# EAGLE schematic GaugeRev2 (EAGLE 6.2)
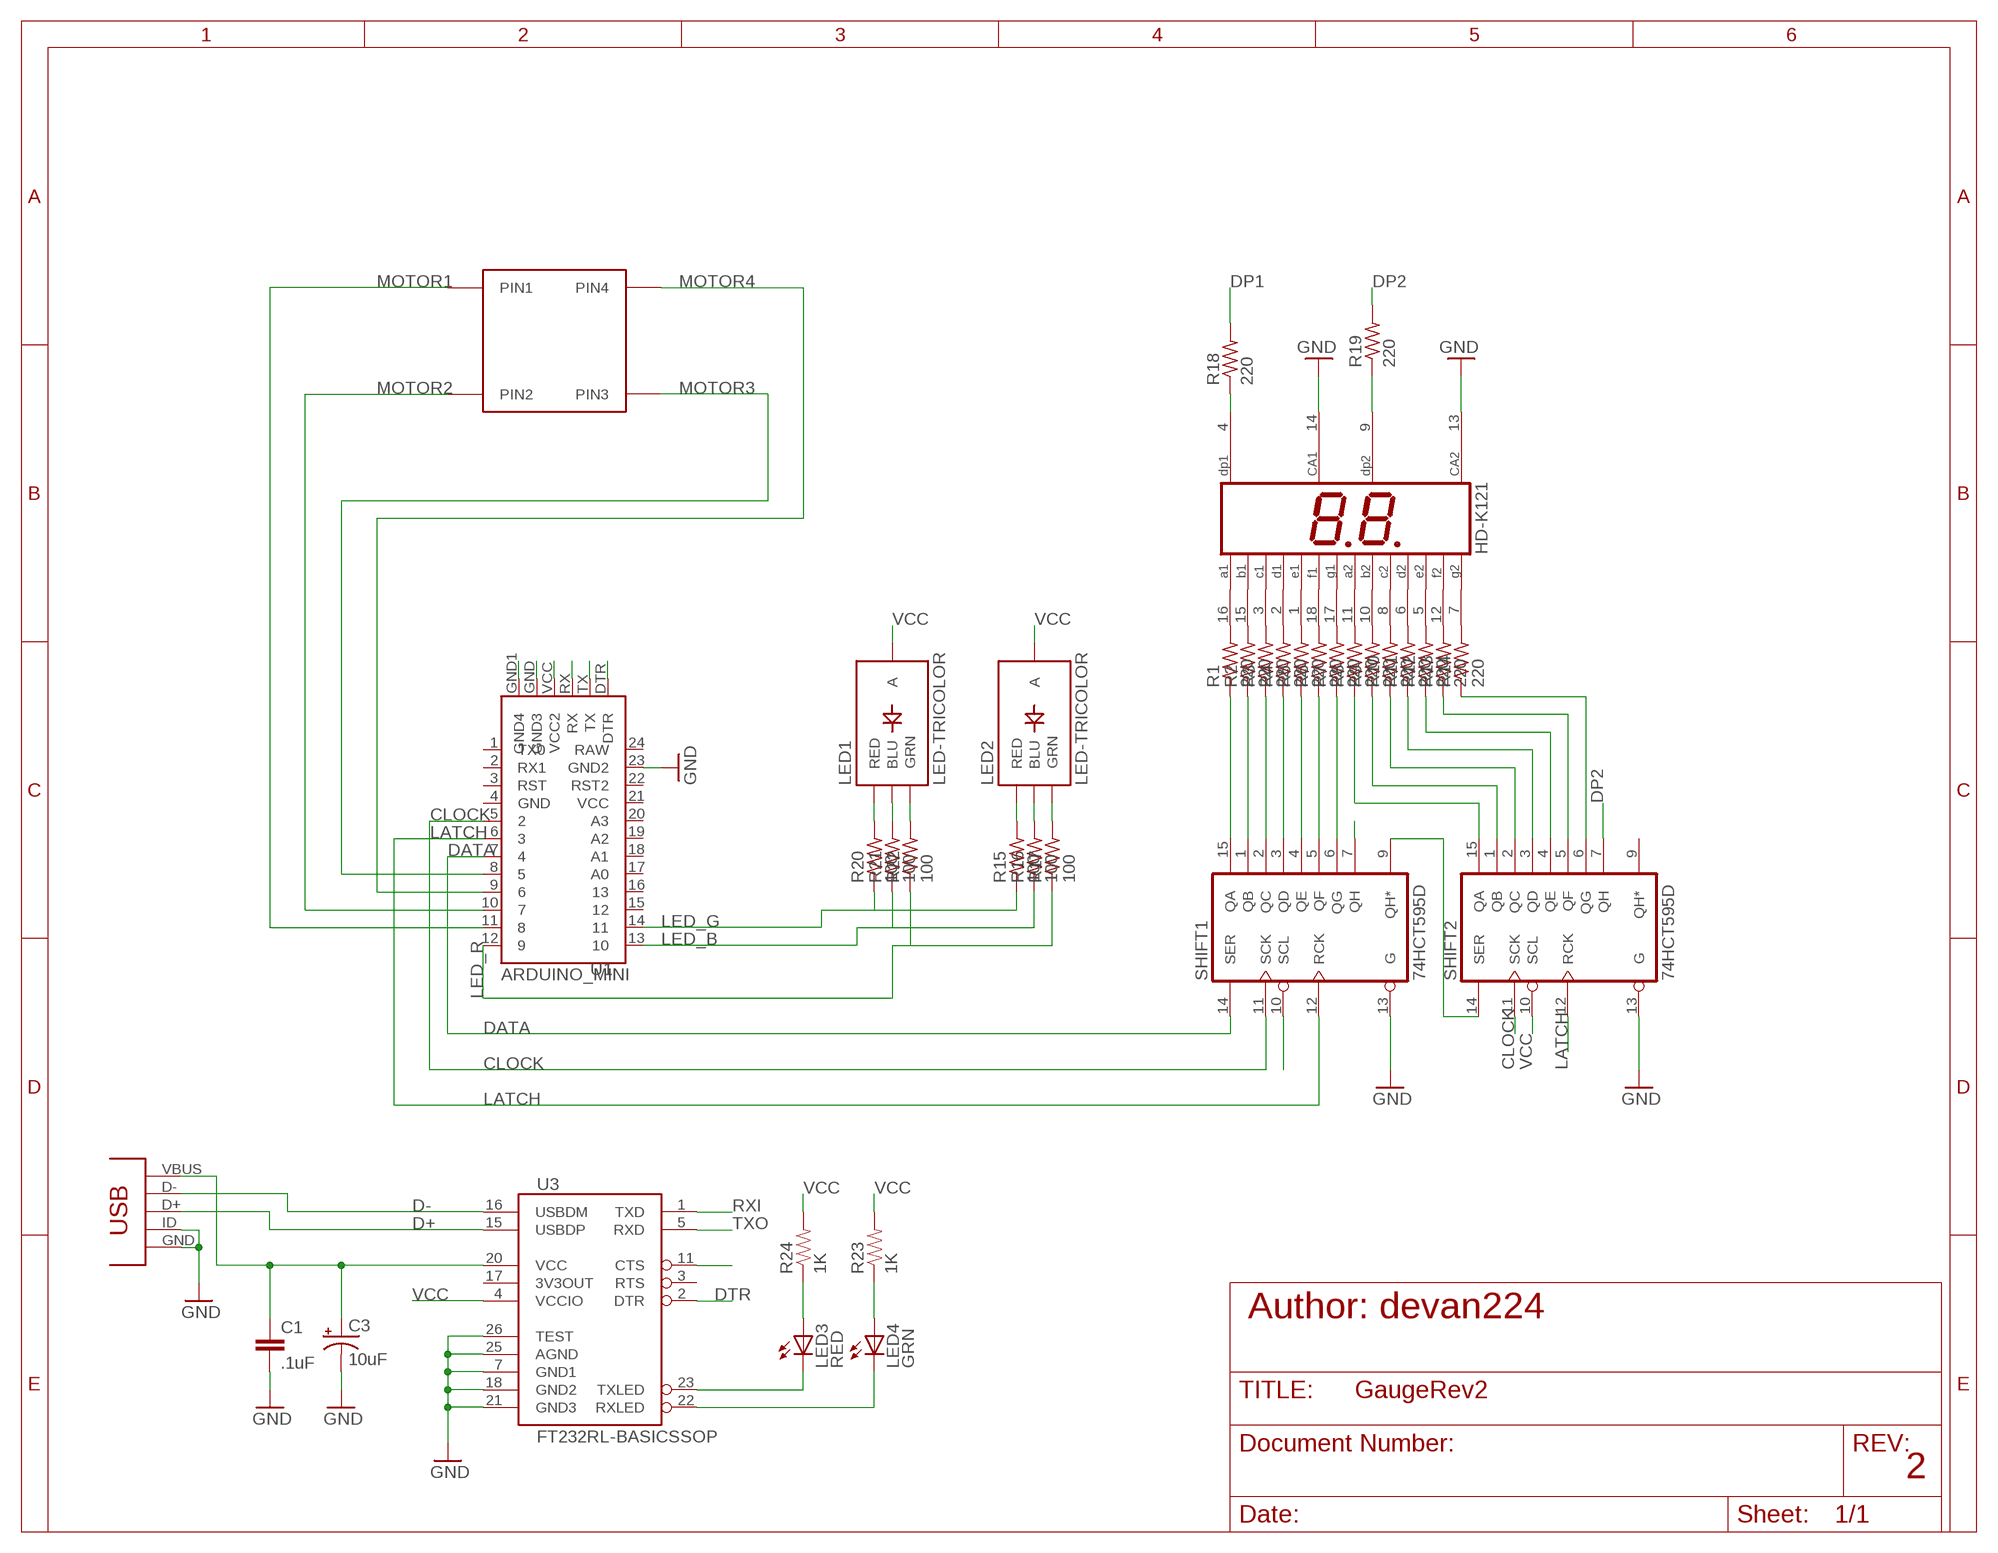
[diagram p0: schematic, sheet 1]

## Parts
C1  .1uF  CAP1210  [1210]
C3  10uF  CAP_POL1206-KIT  [EIA3216-KIT]
DIS2  HD-K121  [HDSP-R]
LED1  LED-TRICOLOR  [LED-TRICOLOR-SMD]
LED2  LED-TRICOLOR  [LED-TRICOLOR-SMD]
LED3  RED  LED1206  [LED-1206]
LED4  GRN  LED1206  [LED-1206]
R1  220  R-US_R1206  [R1206]
R2  220  R-US_R1206  [R1206]
R3  220  R-US_R1206  [R1206]
R4  220  R-US_R1206  [R1206]
R5  220  R-US_R1206  [R1206]
R6  220  R-US_R1206  [R1206]
R7  220  R-US_R1206  [R1206]
R8  220  R-US_R1206  [R1206]
R9  220  R-US_R1206  [R1206]
R10  220  R-US_R1206  [R1206]
R11  220  R-US_R1206  [R1206]
R12  220  R-US_R1206  [R1206]
R13  220  R-US_R1206  [R1206]
R14  220  R-US_R1206  [R1206]
R15  100  R-US_R1206  [R1206]
R16  100  R-US_R1206  [R1206]
R17  100  R-US_R1206  [R1206]
R18  220  R-US_R1206  [R1206]
R19  220  R-US_R1206  [R1206]
R20  100  R-US_R1206  [R1206]
R21  100  R-US_R1206  [R1206]
R22  100  R-US_R1206  [R1206]
R23  1K  RESISTOR1206  [1206]
R24  1K  RESISTOR1206  [1206]
SHIFT1  74HCT595D  [SO16]
SHIFT2  74HCT595D  [SO16]
U1  ARDUINO_MINI  [ARDUINO_MINI]
U2  VID29  [VID29]
U3  FT232RL-BASICSSOP  [SSOP28DB]
U$1  USB-MINI-VERT  [USB-MINI-VERT]

## Nets
1: DIS2.4(DP1) R18.1
2: DIS2.9(DP2) R19.1
A1: R1.1 SHIFT1.15(QA)
A2: R8.1 SHIFT2.15(QA)
B1: R2.1 SHIFT1.1(QB)
B2: R9.1 SHIFT2.1(QB)
C1: R3.1 SHIFT1.2(QC)
CLOCK: SHIFT1.11(SCK) SHIFT2.11(SCK) U1.5
D1: R4.1 SHIFT1.3(QD)
D+: U3.15(USBDP) U$1.D+
D-: U3.16(USBDM) U$1.D-
DATA: SHIFT1.14(SER) U1.7
DP1: R18.2 SHIFT1.7(QH)
DP2: R19.2 SHIFT2.7(QH)
DTR: U1.DTR U3.2(DTR)
E1: R5.1 SHIFT1.4(QE)
F1: R6.1 SHIFT1.5(QF)
G1: R7.1 SHIFT1.6(QG)
G2: R14.1 SHIFT2.6(QG)
GND: C1.2 C3.C(-) DIS2.13(CA2) DIS2.14(CA1) SHIFT1.13(G) SHIFT2.13(G) U1.23(GND2) U1.GND1(GND4) U1.GND(GND3) U3.7(GND1) U3.11(CTS) U3.18(GND2) U3.21(GND3) U3.25(AGND) U3.26(TEST) U$1.GND U$1.ID
LATCH: SHIFT1.12(RCK) SHIFT2.12(RCK) U1.6
LED_B: R16.1 R21.1 U1.13
LED_G: R15.1 R20.1 U1.14
LED_R: R17.1 R22.1 U1.12
MOTOR1: U1.11 U2.PIN1
MOTOR2: U1.10 U2.PIN2
MOTOR3: U1.8 U2.PIN3
MOTOR4: U1.9 U2.PIN4
N$1: DIS2.16(A1) R1.2
N$2: DIS2.15(B1) R2.2
N$3: DIS2.3(C1) R3.2
N$4: DIS2.2(D1) R4.2
N$5: DIS2.1(E1) R5.2
N$6: DIS2.18(F1) R6.2
N$7: DIS2.17(G1) R7.2
N$8: DIS2.11(A2) R8.2
N$9: DIS2.10(B2) R9.2
N$10: DIS2.8(C2) R10.2
N$11: DIS2.6(D2) R11.2
N$12: DIS2.5(E2) R12.2
N$13: DIS2.12(F2) R13.2
N$14: DIS2.7(G2) R14.2
N$15: LED2.G(GRN) R17.2
N$16: LED2.B(BLU) R16.2
N$17: LED3.C U3.23(TXLED)
N$18: LED4.C U3.22(RXLED)
N$19: R10.1 SHIFT2.2(QC)
N$20: R11.1 SHIFT2.3(QD)
N$21: R12.1 SHIFT2.4(QE)
N$22: R13.1 SHIFT2.5(QF)
N$23: LED2.R(RED) R15.2
N$24: LED1.G(GRN) R22.2
N$25: LED1.B(BLU) R21.2
N$26: LED1.R(RED) R20.2
N$27: LED4.A R23.1
N$28: LED3.A R24.1
Q*: SHIFT1.9(QH*) SHIFT2.14(SER)
RXI: U1.RX U3.1(TXD)
TXO: U1.TX U3.5(RXD)
VBUS: C1.1 C3.A(+) U3.20(VCC) U$1.VBUS
VCC: LED1.A LED2.A R23.2 R24.2 SHIFT1.10(SCL) SHIFT2.10(SCL) U1.VCC(VCC2) U3.4(VCCIO)
Unconnected: SHIFT2.9(QH*) U1.1(TX0) U1.2(RX1) U1.3(RST) U1.4(GND) U1.15 U1.16 U1.17(A0) U1.18(A1) U1.19(A2) U1.20(A3) U1.21(VCC) U1.22(RST2) U1.24(RAW) U3.3(RTS) U3.17(3V3OUT)

## Notes on the sheet
- Author: devan224
- 2

## Power pins joined to a net without a drawn wire
GND: SHIFT1.8(GND) SHIFT2.8(GND)
VCC: SHIFT1.16(VCC) SHIFT2.16(VCC)

## Library data of the parts
C1 = SparkFun:CAP: Capacitor Standard 0603 ceramic capacitor, and 0.1" leaded capacitor.
C3 = SparkFun:CAP_POL: Capacitor Polarized These are standard SMD and PTH capacitors. Normally 10uF, 47uF, and 100uF in electrolytic and tantalum varieties. Always verify the external diameter of the through hole cap, it varies with capacity, voltage, and manufacturer. The EIA devices should be standard.
DIS2 = HDSP-523E:HD-K121: LED DISPLAY 2 x 1 character 7 segment, decimal points right; OC_FARNELL: unknown; OC_NEWARK: unknown
LED1 LED2 = SparkFun:LED-TRICOLOR: Tri-Color LED SMD Proven layout and schematic for triple color LED in SMD package - common anode. Spark Fun Electronics SKU : COM-07844
LED3 LED4 = SparkFun:LED: LEDs Standard schematic elements and footprints for 5mm, 3mm, 1206, and 0603 sized LEDs. 5mm - Spark Fun Electronics SKU : COM-00529 (and others)
R1-R22 = resistor:R-US_: RESISTOR, American symbol
R23 R24 = SparkFun:RESISTOR: Resistor Basic schematic elements and footprints for 0603, 1206, and PTH resistors.
SHIFT1 SHIFT2 = 74xx-eu:74*595: 8-bit SHIFT REGISTER, output latch
U1 = SparkFun:ARDUINO_MINI
U2 = Evans:VID29
U3 = SparkFun:FT232RL-BASIC: USB UART This is the simplified version of the FT232RL unit. Only what you need, nothing you don't. Spark Fun Electronics SKU : COM-00650
U$1 = Evans:USB-MINI-VERT